# Altium schematic sheet 03.SchDoc
size 420 x 297 mm
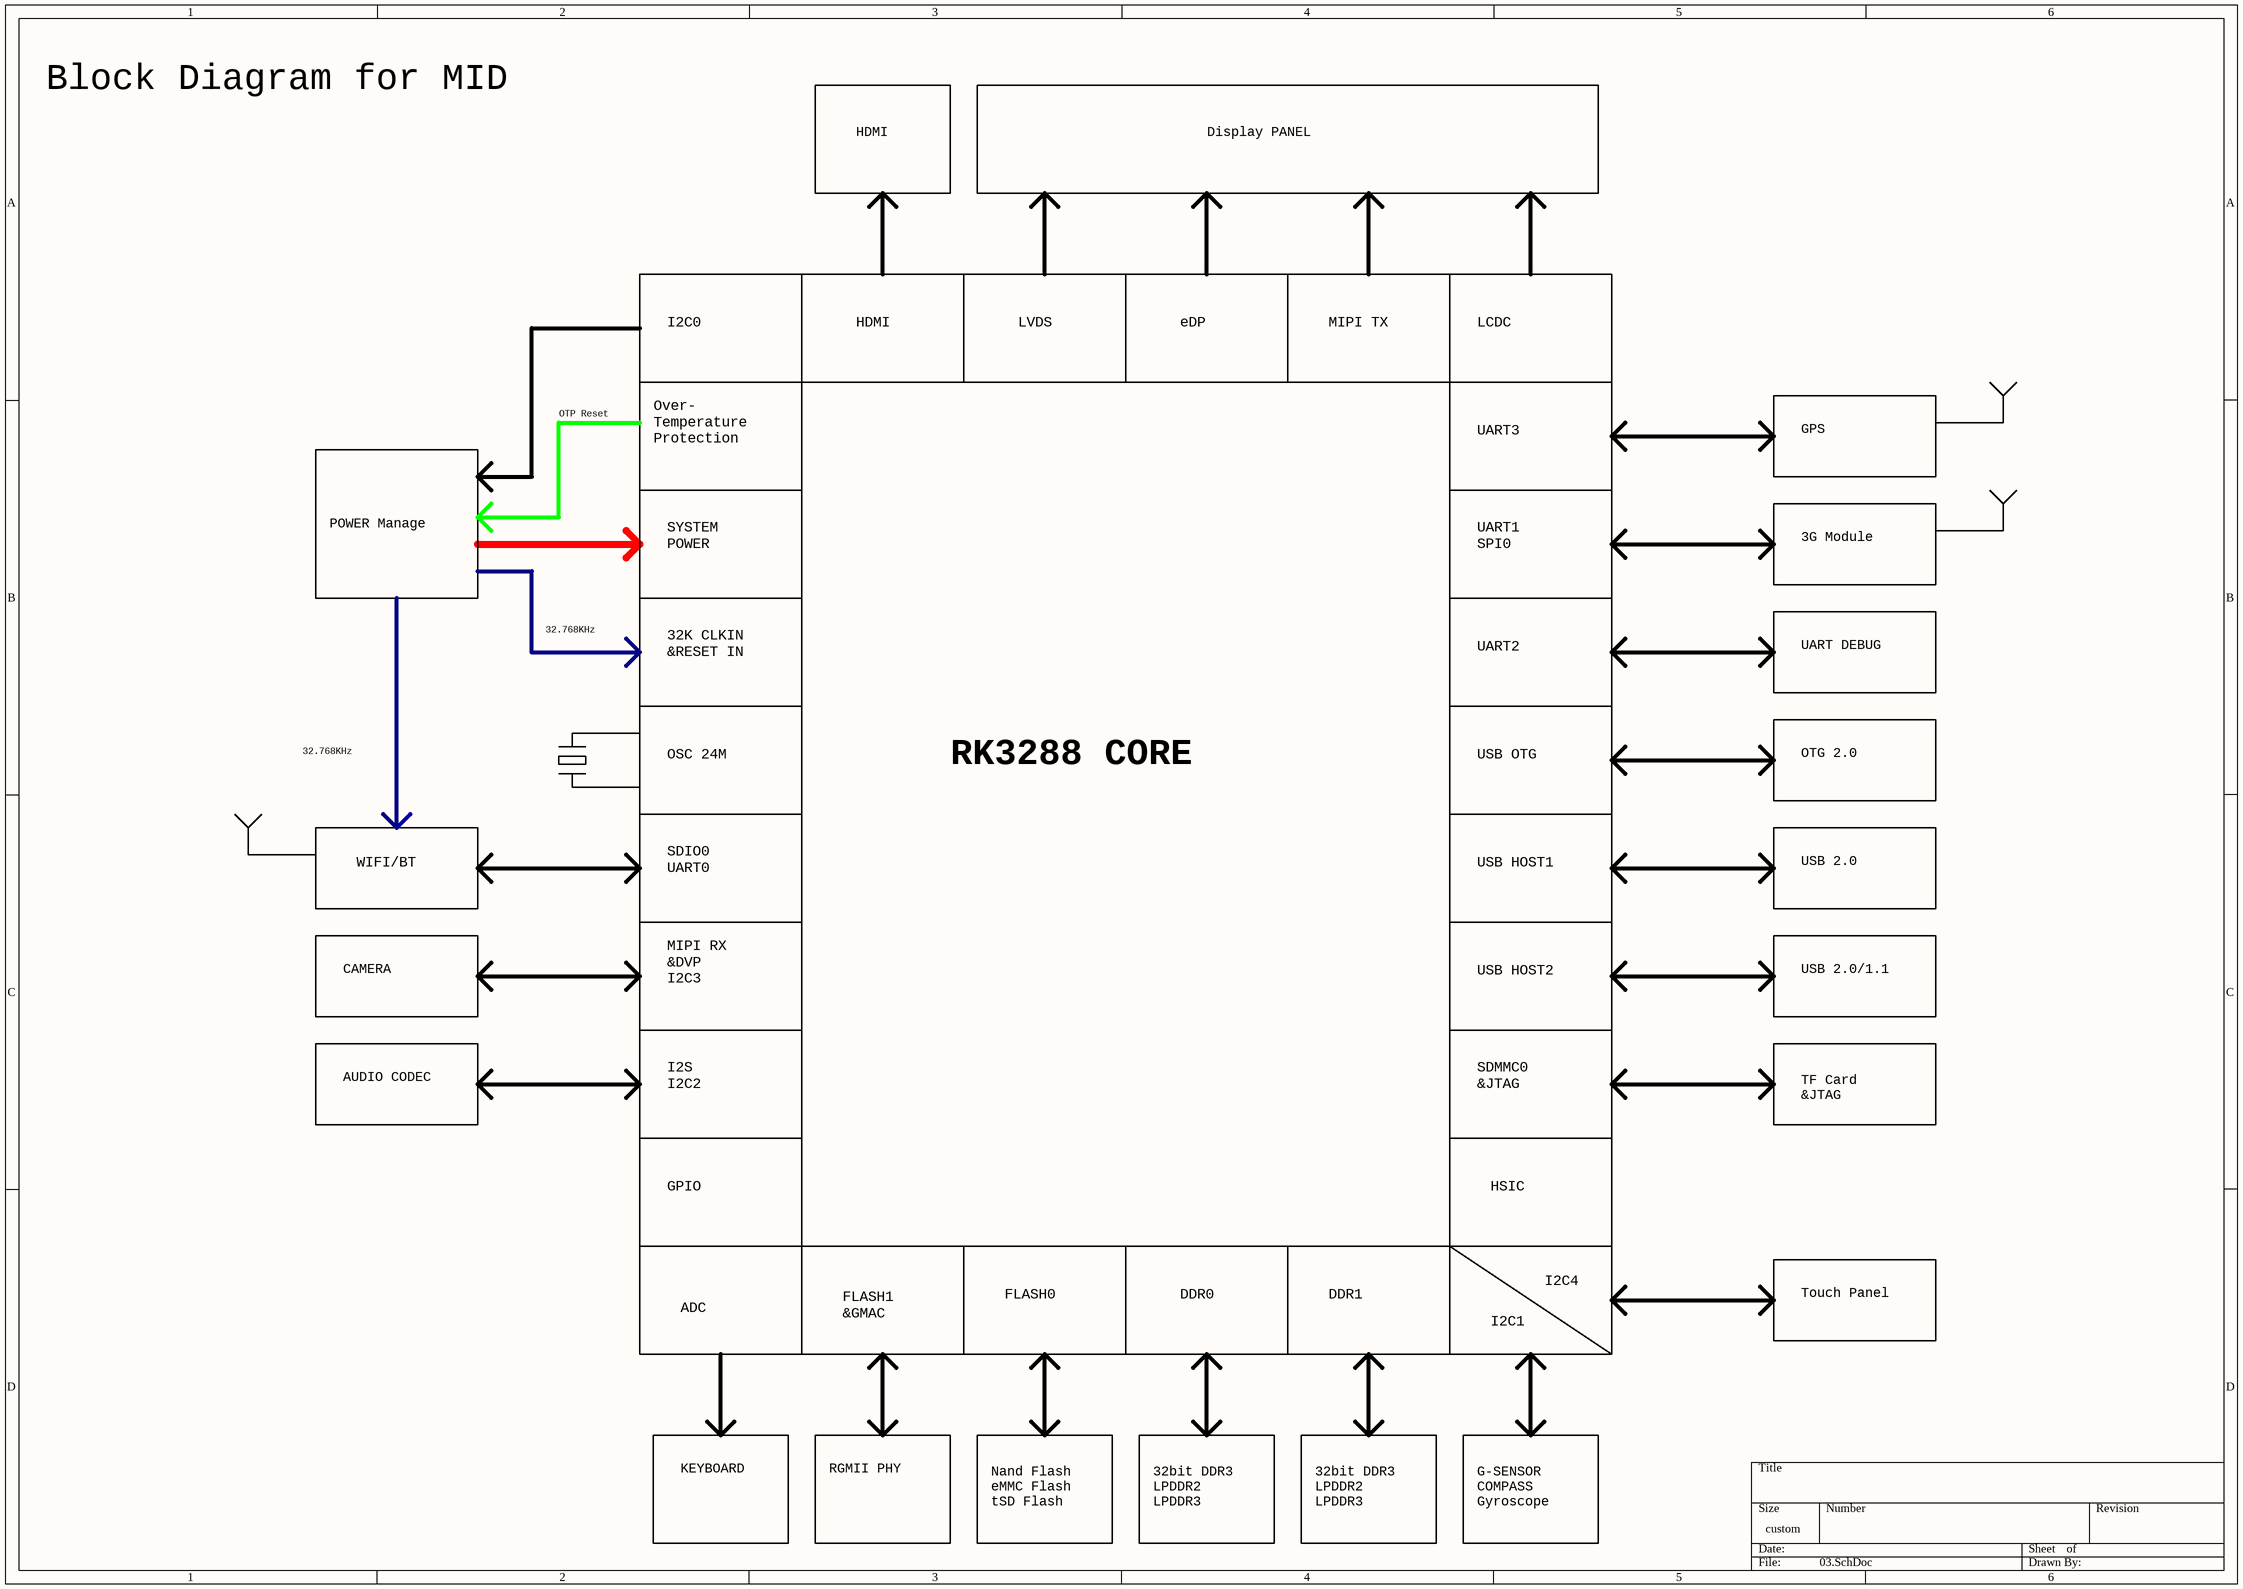
[diagram p0: 03.SchDoc]

## Notes on the sheet
- Block Diagram for MID
- HDMI
- Display PANEL
- I2C0
- LVDS
- eDP
- MIPI TX
- LCDC
- Over-
  Temperature
  Protection
- OTP Reset
- UART3
- GPS
- POWER Manage
- SYSTEM
  POWER
- UART1
  SPI0
- 3G Module
- 32.768KHz
- 32K CLKIN
  &RESET IN
- UART2
- UART DEBUG
- OSC 24M
- RK3288 CORE
- USB OTG
- OTG 2.0
- WIFI/BT
- SDIO0
  UART0
- USB HOST1
- USB 2.0
- MIPI RX
  &DVP
  I2C3
- CAMERA
- USB HOST2
- USB 2.0/1.1
- I2S
  I2C2
- SDMMC0
  &JTAG
- TF Card
  &JTAG
- AUDIO CODEC
- GPIO
- HSIC
- ADC
- FLASH1
  &GMAC
- FLASH0
- DDR0
- DDR1
- I2C1
- I2C4
- Touch Panel
- KEYBOARD
- RGMII PHY
- Nand Flash
  eMMC Flash
  tSD Flash
- 32bit DDR3
  LPDDR2
  LPDDR3
- G-SENSOR
  COMPASS
  Gyroscope